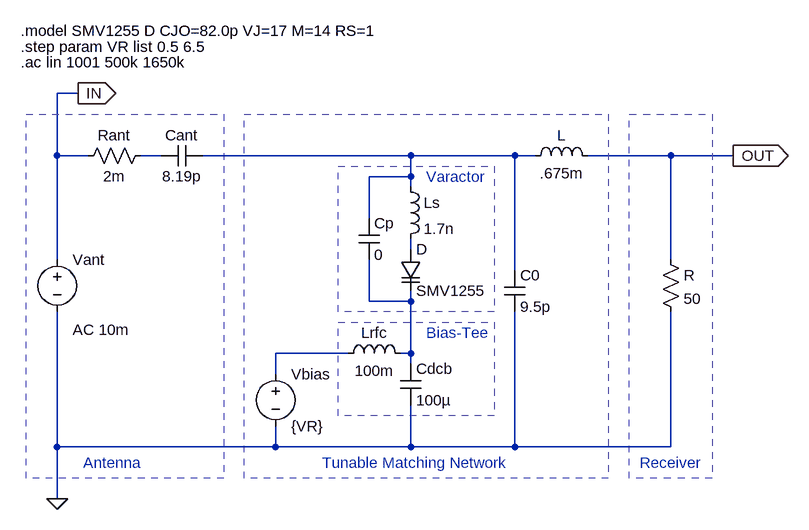
[diagram p0: schematic Task2_1255_McDade.asc]
Task2_1255_McDade.asc, the LTspice schematic file:
Version 4
SHEET 1 1032 996
WIRE -1120 -16 -1152 -16
WIRE -1152 80 -1152 -16
WIRE -1104 80 -1152 80
WIRE -992 80 -1024 80
WIRE -608 80 -928 80
WIRE -448 80 -608 80
WIRE -416 80 -448 80
WIRE -208 80 -336 80
WIRE -112 80 -208 80
WIRE -608 112 -608 80
WIRE -608 112 -672 112
WIRE -608 128 -608 112
WIRE -672 176 -672 112
WIRE -608 224 -608 208
WIRE -1152 240 -1152 80
WIRE -208 240 -208 80
WIRE -448 256 -448 80
WIRE -672 304 -672 240
WIRE -608 304 -608 288
WIRE -608 304 -672 304
WIRE -704 384 -816 384
WIRE -608 384 -608 304
WIRE -608 384 -624 384
WIRE -608 400 -608 384
WIRE -816 416 -816 384
WIRE -1152 528 -1152 320
WIRE -816 528 -816 496
WIRE -816 528 -1152 528
WIRE -608 528 -608 464
WIRE -608 528 -816 528
WIRE -448 528 -448 320
WIRE -448 528 -608 528
WIRE -208 528 -208 320
WIRE -208 528 -448 528
WIRE -1152 608 -1152 528
FLAG -1152 608 0
FLAG -112 80 OUT
IOPIN -112 80 Out
FLAG -1120 -16 IN
IOPIN -1120 -16 Out
SYMBOL voltage -1152 224 R0
WINDOW 3 24 152 Invisible 2
WINDOW 123 24 124 Left 2
WINDOW 39 0 0 Left 2
SYMATTR Value 0
SYMATTR Value2 AC 10m
SYMATTR InstName Vant
SYMBOL cap -928 64 R90
WINDOW 0 0 32 VBottom 2
WINDOW 3 32 32 VTop 2
SYMATTR InstName Cant
SYMATTR Value 8.19p
SYMBOL res -1008 64 R90
WINDOW 0 0 56 VBottom 2
WINDOW 3 32 56 VTop 2
SYMATTR InstName Rant
SYMATTR Value 2m
SYMBOL cap -464 256 R0
SYMATTR InstName C0
SYMATTR Value 9.5p
SYMBOL res -224 224 R0
SYMATTR InstName R
SYMATTR Value 50
SYMBOL ind -624 112 R0
SYMATTR InstName Ls
SYMATTR Value 1.7n
SYMBOL cap -688 176 R0
SYMATTR InstName Cp
SYMATTR Value 0
SYMBOL varactor -624 224 R0
SYMATTR InstName D
SYMATTR Value SMV1255
SYMBOL ind -720 400 R270
WINDOW 0 32 56 VTop 2
WINDOW 3 5 56 VBottom 2
SYMATTR InstName Lrfc
SYMATTR Value 100m
SYMBOL cap -624 400 R0
SYMATTR InstName Cdcb
SYMATTR Value 100µ
SYMBOL voltage -816 400 R0
WINDOW 123 0 0 Left 2
WINDOW 39 0 0 Left 2
SYMATTR InstName Vbias
SYMATTR Value {VR}
SYMBOL ind -432 96 R270
WINDOW 0 32 56 VTop 2
WINDOW 3 5 56 VBottom 2
SYMATTR InstName L
SYMATTR Value .675m
TEXT -1208 -112 Left 2 !.model SMV1255 D CJO=82.0p VJ=17 M=14 RS=1
TEXT -1208 -64 Left 2 !.ac lin 1001 500k 1650k
TEXT -1208 -88 Left 2 !.step param VR list 0.5 6.5
TEXT -1112 552 Left 2 ;Antenna
TEXT -256 552 Left 2 ;Receiver
TEXT -584 112 Left 2 ;Varactor
TEXT -584 352 Left 2 ;Bias-Tee
TEXT -744 552 Left 2 ;Tunable Matching Network
RECTANGLE Normal -896 576 -1200 16 2
RECTANGLE Normal -144 576 -272 16 2
RECTANGLE Normal -720 96 -480 320 2
RECTANGLE Normal -864 16 -304 576 2
RECTANGLE Normal -720 336 -480 480 2

The netlist it stands for:
* Task2_1255_McDade.asc
Vant IN 0 0 AC 10m
Cant N002 N001 8.19p
Rant N001 IN 2m
C0 N002 0 9.5p
R OUT 0 50
Ls N002 N003 1.7n
Cp N002 N004 0
D N003 N004 SMV1255
Lrfc N005 N004 100m
Cdcb N004 0 100µ
Vbias N005 0 {VR}
L N002 OUT .675m
.model D D
.lib standard.dio
.model SMV1255 D CJO=82.0p VJ=17 M=14 RS=1
.ac lin 1001 500k 1650k
.step param VR list 0.5 6.5
* Antenna
* Receiver
* Varactor
* Bias-Tee
* Tunable Matching Network
.backanno
.end